# EAGLE schematic TC_break (EAGLE 7.3.0)
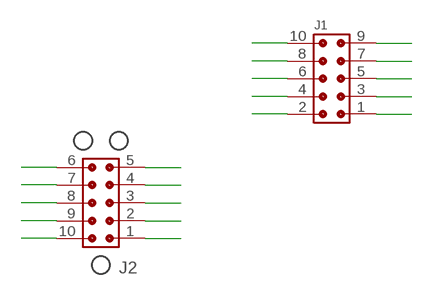
[diagram p0: schematic, sheet 1]

## Parts
J1  CONN_5X2_1P00_IN  [CONN_5X2_0P100_IN]
J2  TC_2050_IDC_NL_TOP  [TC_2050_IDC_NL_TOP]

## Nets
1: J1.1 J2.1
2: J1.3 J2.2
3: J1.5 J2.3
4: J1.7 J2.4
5: J1.9 J2.5
6: J1.10 J2.6
7: J1.8 J2.7
8: J1.6 J2.8
9: J1.4 J2.9
10: J1.2 J2.10

## Library data of the parts
J1 = leaf:CONN_5X2_1P00_IN
J2 = leaf:TC_2050_IDC_NL_TOP